# EAGLE design IMU (EAGLE 7.1.0)
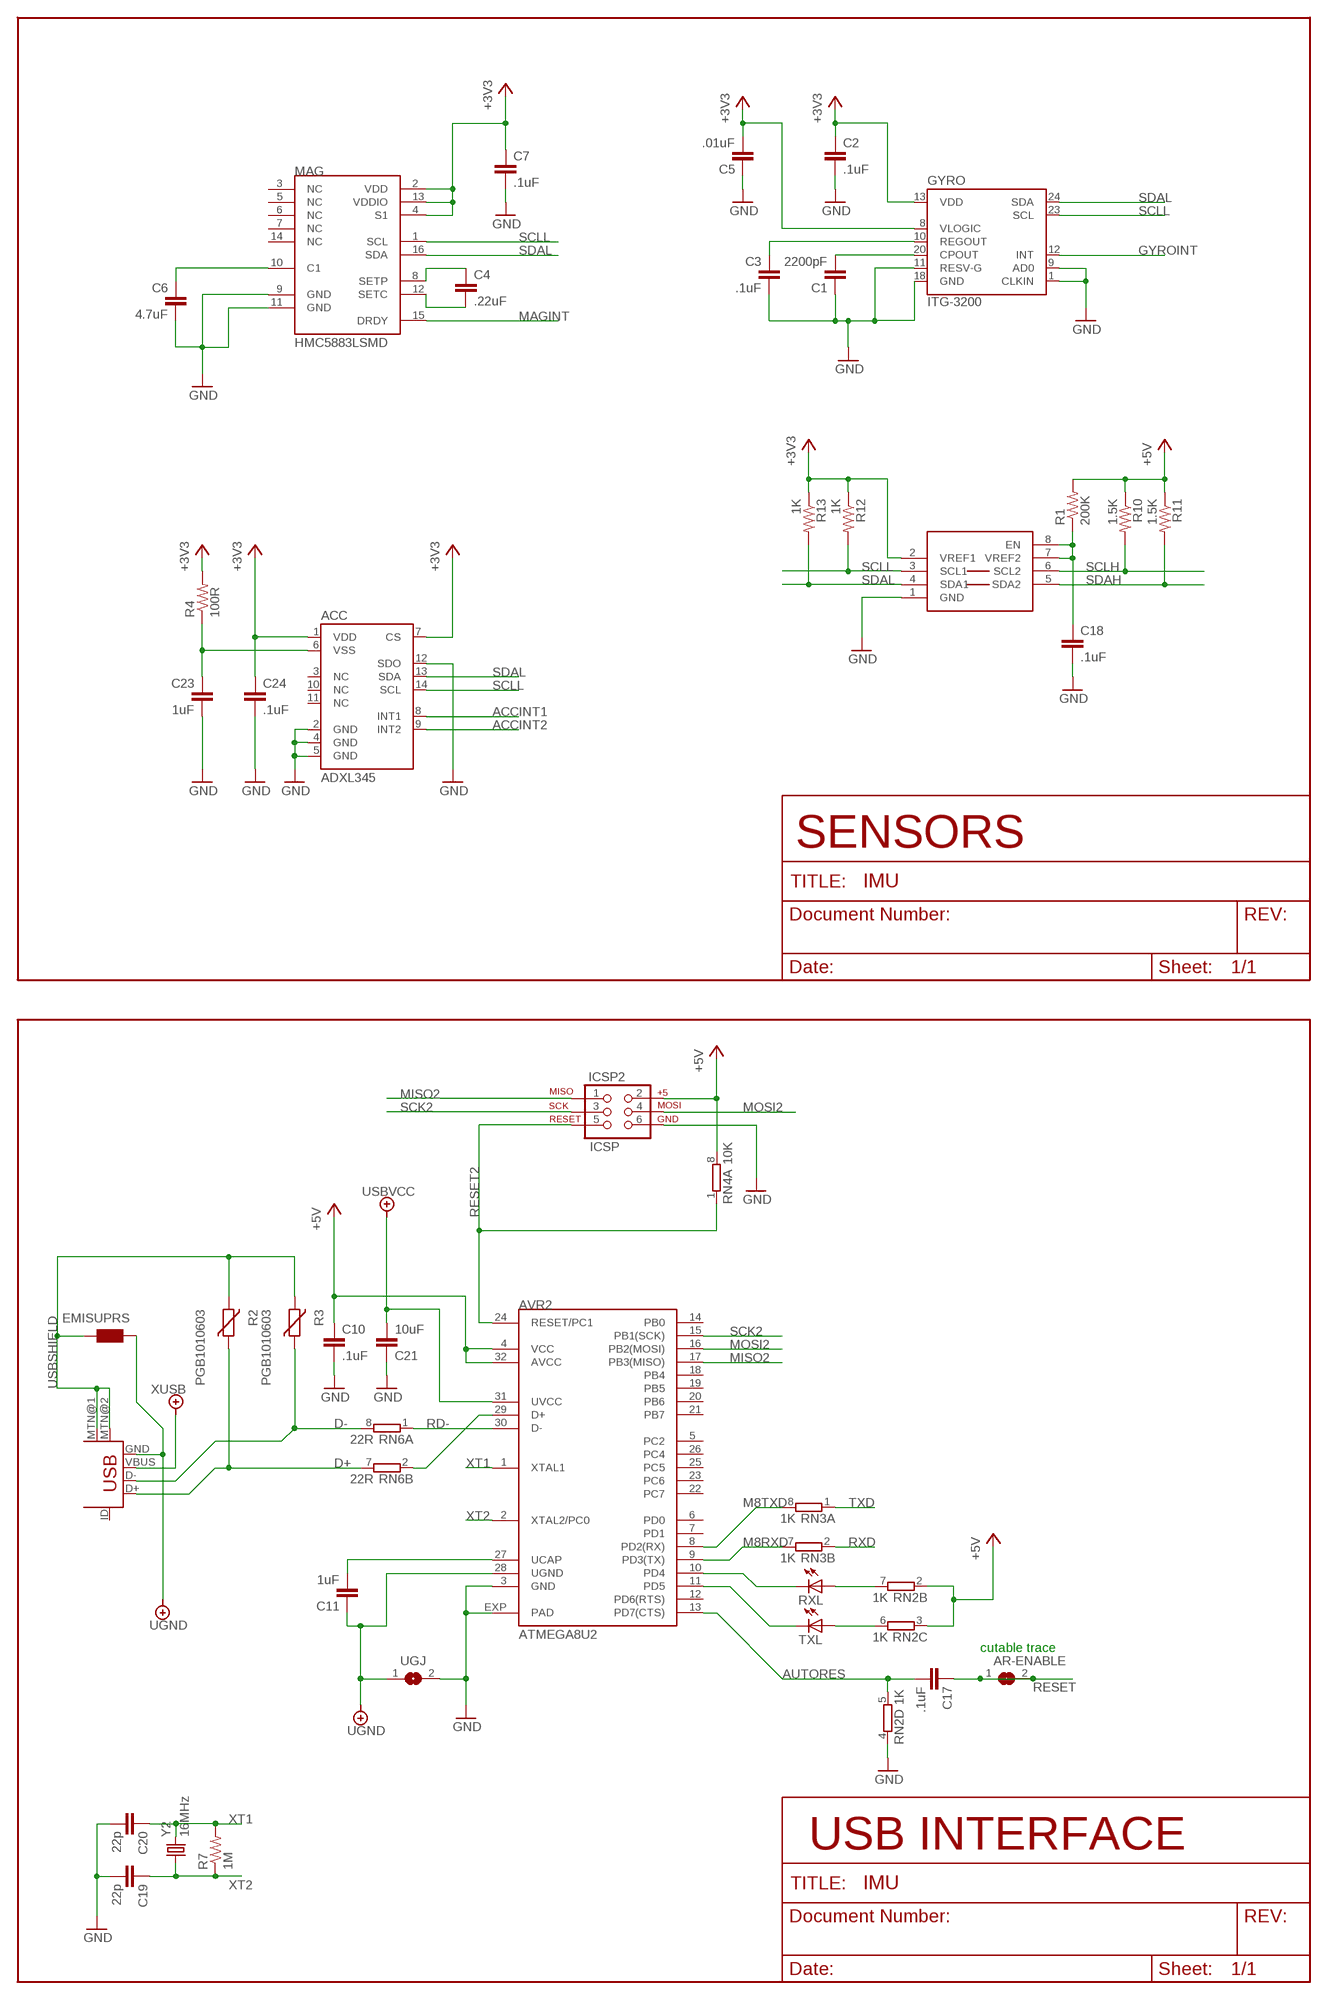
[diagram p0: schematic, sheet 1, part 1 of 2]
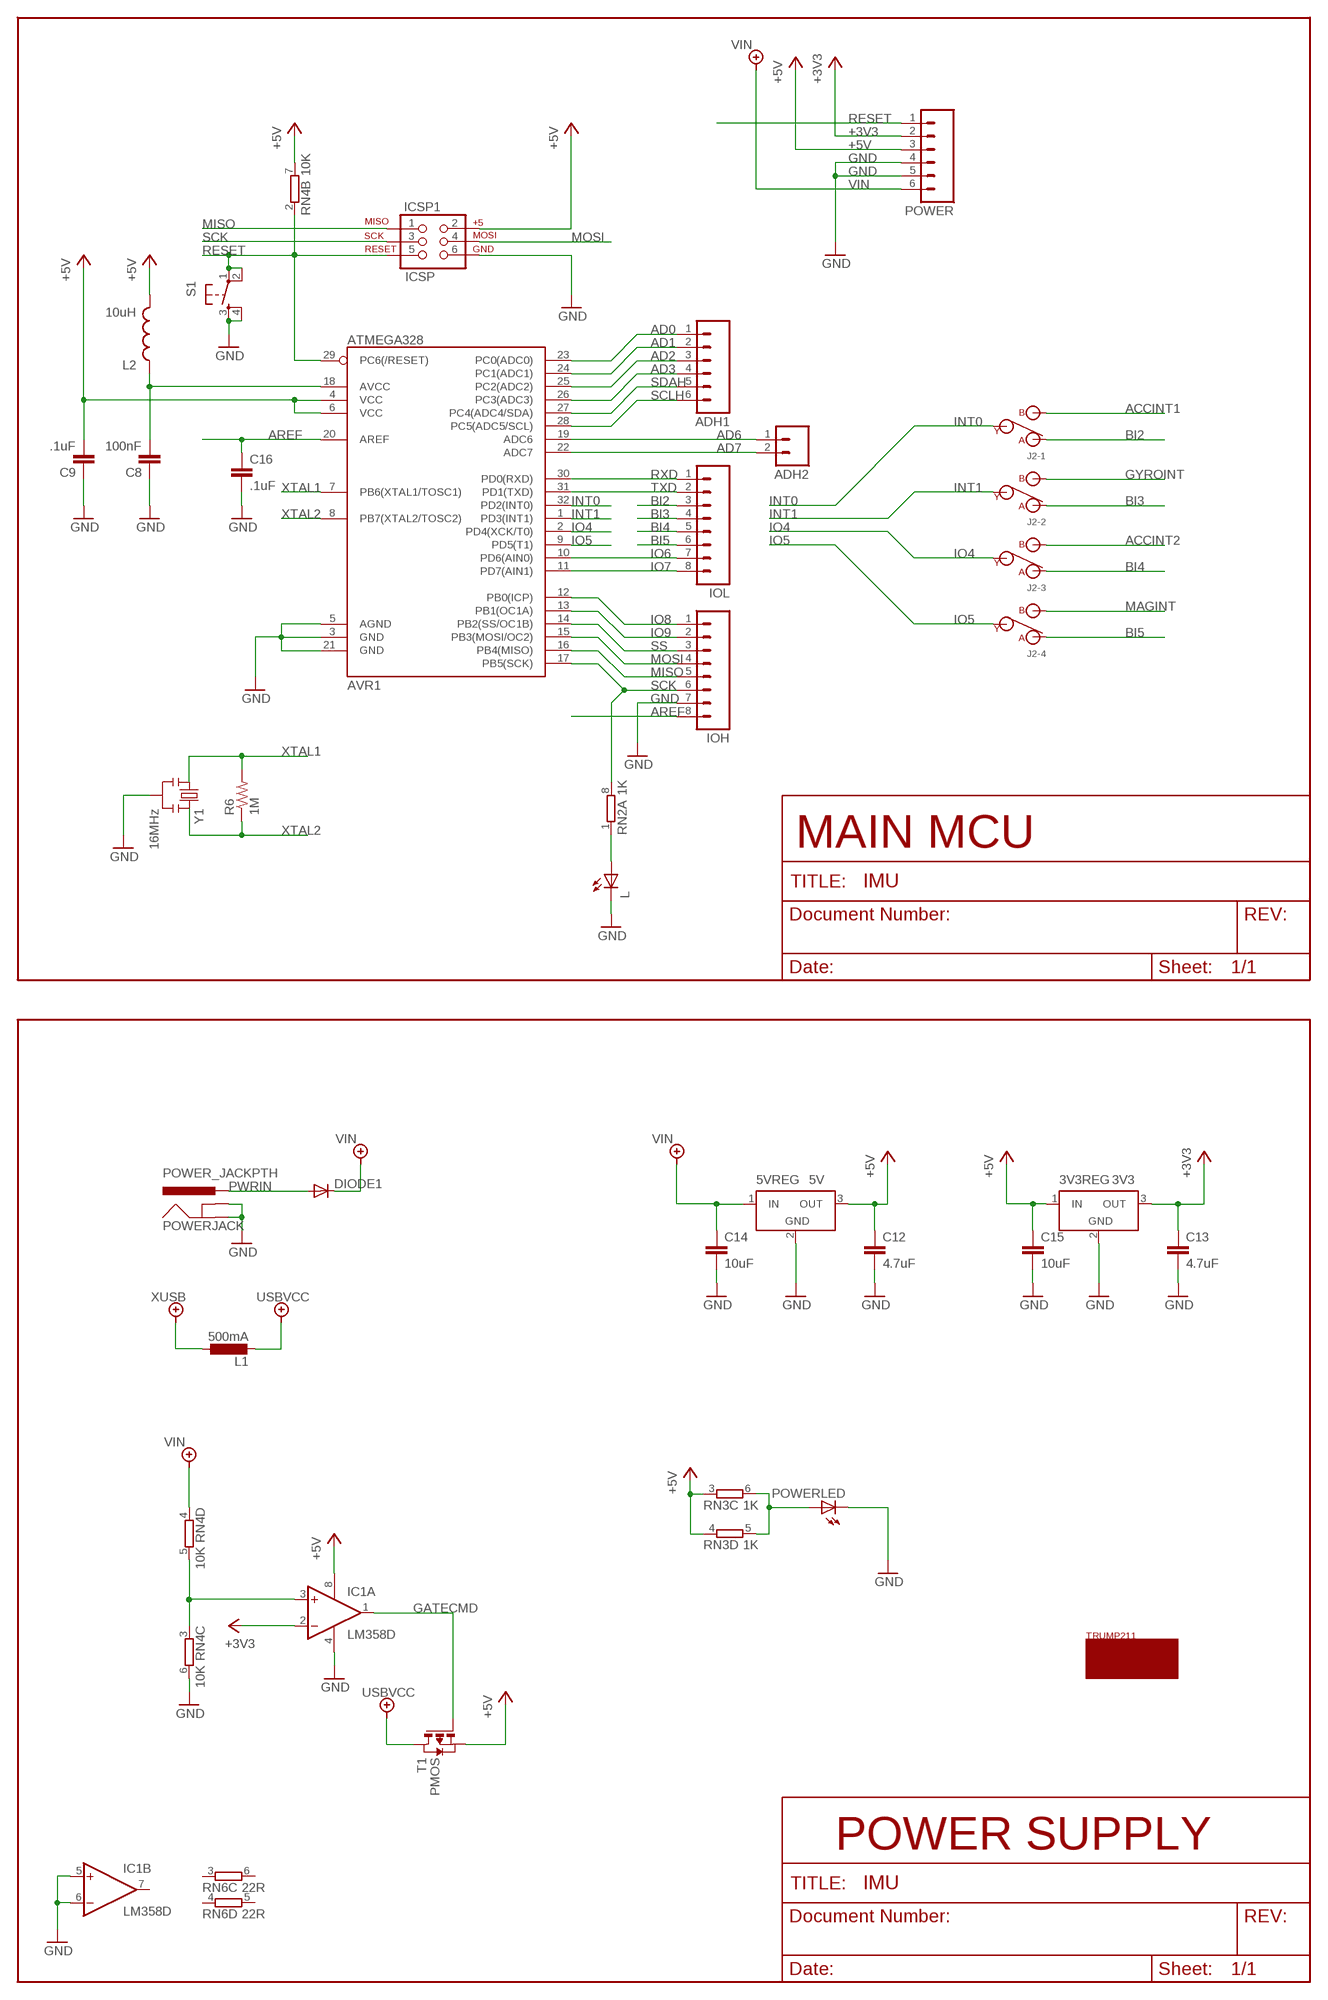
[diagram p1: schematic, sheet 1, part 2 of 2]

## Parts
3V3REG  3V3  LT1129CST5  [SOT223]
5VREG  5V  LT1129CST5  [SOT223]
ACC  ADXL345  [LGA14]
ADH1  M06LOCK  [1X06_LOCK]
ADH2  M02LOCK  [1X02_LOCK]
AR-ENABLE  SJ  [SJ]
AVR1  ATMEGA328  ATMEGA168  [TQFP32-08]
AVR2  ATMEGA8U2  [QFN32]
C1  2200pF  C-EUC0603  [C0603]
C2  .1uF  C-EUC0603  [C0603]
C3  .1uF  C-EUC0603  [C0603]
C4  .22uF  C-EUC0805  [C0805]
C5  .01uF  C-EUC0603  [C0603]
C6  4.7uF  C-EUC0805  [C0805]
C7  .1uF  C-EUC0603  [C0603]
C8  100nF  C-EUC0603  [C0603]
C9  .1uF  C-EUC0603  [C0603]
C10  .1uF  C-EUC0603  [C0603]
C11  1uF  C-EUC0603  [C0603]
C12  4.7uF  C-EUC1206  [C1206]
C13  4.7uF  C-EUC1206  [C1206]
C14  10uF  C-EUC1206  [C1206]
C15  10uF  C-EUC1206  [C1206]
C16  .1uF  C-EUC0603  [C0603]
C17  .1uF  C-EUC0603  [C0603]
C18  .1uF  C-EUC0603  [C0603]
C19  22p  C-EUC0603  [C0603]
C20  22p  C-EUC0603  [C0603]
C21  10uF  C-EUC0805  [C0805]
C23  1uF  C-EUC0805  [C0805]
C24  .1uF  C-EUC0603  [C0603]
DIODE1  DIODESMA  [SMA-DIODE]
EMISUPRS  WE-CBF_0805  [0805]
GYRO  ITG-3200  [QFN-24]
IC1  LM358D  [SO08]
ICSP1  ICSP  AVR_SPI_PRG_62X3_LOCK  [2X3_LOCK]
ICSP2  ICSP  AVR_SPI_PRG_62X3_LOCK  [2X3_LOCK]
IOH  M08LOCK  [1X08_LOCK]
IOL  M08LOCK  [1X08_LOCK]
J2  4POS_SPDT_DIP  [4X3_JUMP]
L  LEDCHIP-LED0805  [CHIP-LED0805]
L1  500mA  L-EUL1812  [L1812]
L2  10uH  INDUCTOR0805  [0805]
MAG  HMC5883LSMD  [16LPCC]
MINIUSB  USBMINI  [USBMINI]
POWER  M06LOCK  [1X06_LOCK]
POWERJACK  POWER_JACKPTH  [POWER_JACK_PTH]
POWERLED  LEDCHIP-LED0805  [CHIP-LED0805]
R1  200K  R-US_R0603  [R0603]
R2  PGB1010603  VARISTORCN0603  [CT/CN0603]
R3  PGB1010603  VARISTORCN0603  [CT/CN0603]
R4  100R  R-US_R0603  [R0603]
R6  1M  R-US_R0603  [R0603]
R7  1M  R-US_R0603  [R0603]
R10  1.5K  R-US_R0603  [R0603]
R11  1.5K  R-US_R0603  [R0603]
R12  1K  R-US_R0603  [R0603]
R13  1K  R-US_R0603  [R0603]
RN2  1K  4R-NCAY16  [CAY16]
RN3  1K  4R-NCAY16  [CAY16]
RN4  10K  4R-NCAY16  [CAY16]
RN6  22R  4R-NCAY16  [CAY16]
RXL  LEDCHIP-LED0805  [CHIP-LED0805]
S1  TAC_SWITCHSMD  [TACTILE_SWITCH_SMD]
T1  PMOS  PMOSSOT23  [SOT-23]
TRANSLATOR  PCA9306  [PSOP-8]
TXL  LEDCHIP-LED0805  [CHIP-LED0805]
U$1  TRUMPLOGO  [TRUMPLOGO]
UGJ  SJ  [SJ]
Y1  16MHz  RESONATORSMD  [RESONATOR-SMD]
Y2  16MHz  CRYSTAL  [CRYSTALSMD]

## Nets
5VREF: C18.1 R1.1 TRANSLATOR.7(VREF2) TRANSLATOR.8(EN)
+3V3: 3V3REG.3(OUT) ACC.1(VDD) ACC.7(CS) C2.1 C5.2 C7.1 C13.1 C24.1 GYRO.8(VLOGIC) GYRO.13(VDD) IC1.2(A:-IN) MAG.2(VDD) MAG.4(S1) MAG.13(VDDIO) POWER.2 R4.2 R12.1 R13.1 TRANSLATOR.2(VREF1)
+5V: 3V3REG.1(IN) 5VREG.3(OUT) AVR1.4(VCC) AVR1.6(VCC) AVR2.4(VCC) AVR2.32(AVCC) C9.2 C10.1 C12.1 C15.1 IC1.8(P:V+) ICSP1.2 ICSP2.2 L2.2 POWER.3 R1.2 R10.1 R11.1 RN2.2 RN2.3 RN3.3 RN3.4 RN4.7 RN4.8 T1.2(S)
ACCINT1: ACC.8(INT1) J2.R1(-1:B)
ACCINT2: ACC.9(INT2) J2.R3(-3:B)
AD0: ADH1.1 AVR1.23(PC0(ADC0))
AD1: ADH1.2 AVR1.24(PC1(ADC1))
AD2: ADH1.3 AVR1.25(PC2(ADC2))
AD3: ADH1.4 AVR1.26(PC3(ADC3))
AD6: ADH2.1 AVR1.19(ADC6)
AD7: ADH2.2 AVR1.22(ADC7)
AREF: AVR1.20(AREF) C16.1 IOH.8
AUTORES: AVR2.13(PD7(CTS)) C17.2 RN2.5
BI2: IOL.3 J2.L1(-1:A)
BI3: IOL.4 J2.L2(-2:A)
BI4: IOL.5 J2.L3(-3:A)
BI5: IOL.6 J2.L4(-4:A)
CPOUT: C1.2 GYRO.20(CPOUT)
D+: MINIUSB.D+ R2.1 RN6.7
D-: MINIUSB.D- R3.1 RN6.8
GATECMD: IC1.1(A:OUT) T1.3(G)
GND: 3V3REG.2(GND) 5VREG.2(GND) ACC.2(GND) ACC.4(GND) ACC.5(GND) ACC.12(SDO) AVR1.3(GND) AVR1.5(AGND) AVR1.21(GND) AVR2.3(GND) AVR2.EXP(PAD) C1.1 C2.2 C3.2 C5.1 C6.2 C7.2 C8.1 C9.1 C10.2 C12.2 C13.2 C14.2 C15.2 C16.2 C18.2 C19.2 C20.2 C21.1 C23.2 C24.2 GYRO.1(CLKIN) GYRO.9(AD0) GYRO.11(RESV-G) GYRO.18(GND) IC1.4(P:V-) IC1.5(B:+IN) IC1.6(B:-IN) ICSP1.6 ICSP2.6 IOH.7 L.C MAG.9(GND) MAG.11(GND) POWER.4 POWER.5 POWERJACK.GND POWERJACK.GNDBREAK POWERLED.C RN2.4 RN4.6 S1.3 S1.4 TRANSLATOR.1(GND) UGJ.2 Y1.2
GYROINT: GYRO.12(INT) J2.R2(-2:B)
INT0: AVR1.32(PD2(INT0)) J2.M1(-1:Y)
INT1: AVR1.1(PD3(INT1)) J2.M2(-2:Y)
IO4: AVR1.2(PD4(XCK/T0)) J2.M3(-3:Y)
IO5: AVR1.9(PD5(T1)) J2.M4(-4:Y)
IO6: AVR1.10(PD6(AIN0)) IOL.7
IO7: AVR1.11(PD7(AIN1)) IOL.8
IO8: AVR1.12(PB0(ICP)) IOH.1
IO9: AVR1.13(PB1(OC1A)) IOH.2
M8RXD: AVR2.9(PD3(TX)) RN3.7
M8TXD: AVR2.8(PD2(RX)) RN3.8
MAGINT: J2.R4(-4:B) MAG.15(DRDY)
MISO: AVR1.16(PB4(MISO)) ICSP1.1 IOH.5
MISO2: AVR2.17(PB3(MISO)) ICSP2.1
MOSI: AVR1.15(PB3(MOSI/OC2)) ICSP1.4 IOH.4
MOSI2: AVR2.16(PB2(MOSI)) ICSP2.4
N$1: C6.1 MAG.10(C1)
N$2: C3.1 GYRO.10(REGOUT)
N$5: ACC.6(VSS) C23.1 R4.1
N$8: RN2.7 RXL.A
N$9: RN2.6 TXL.A
N$10: AVR1.18(AVCC) C8.2 L2.1
N$99: L.A RN2.1
PWRIN: DIODE1.A POWERJACK.PWR
PWRLED: POWERLED.A RN3.5 RN3.6
RD+: AVR2.29(D+) RN6.2
RD-: AVR2.30(D-) RN6.1
RESET: AR-ENABLE.1 AR-ENABLE.2 AVR1.29(PC6(/RESET)) C17.1 ICSP1.5 POWER.1 RN4.2 S1.1 S1.2
RESET2: AVR2.24(RESET/PC1) ICSP2.5 RN4.1
RXD: AVR1.30(PD0(RXD)) IOL.1 RN3.2
RXLED: AVR2.10(PD4) RXL.C
SCK: AVR1.17(PB5(SCK)) ICSP1.3 IOH.6 RN2.8
SCK2: AVR2.15(PB1(SCK)) ICSP2.3
SCLH: ADH1.6 AVR1.28(PC5(ADC5/SCL)) R10.2 TRANSLATOR.6(SCL2)
SCLL: ACC.14(SCL) GYRO.23(SCL) MAG.1(SCL) R12.2 TRANSLATOR.3(SCL1)
SDAH: ADH1.5 AVR1.27(PC4(ADC4/SDA)) R11.2 TRANSLATOR.5(SDA2)
SDAL: ACC.13(SDA) GYRO.24(SDA) MAG.16(SDA) R13.2 TRANSLATOR.4(SDA1)
SETC: C4.2 MAG.12(SETC)
SETP: C4.1 MAG.8(SETP)
SS: AVR1.14(PB2(SS/OC1B)) IOH.3
TXD: AVR1.31(PD1(TXD)) IOL.2 RN3.1
TXLED: AVR2.11(PD5) TXL.C
UGND: AVR2.28(UGND) C11.1 EMISUPRS.1 MINIUSB.GND UGJ.1
USBSHIELD: EMISUPRS.2 MINIUSB.MTN@1 MINIUSB.MTN@2 R2.2 R3.2
USBVCC: AVR2.31(UVCC) C21.2 L1.2 T1.1(D)
VIN: 5VREG.1(IN) C14.1 DIODE1.C POWER.6 RN4.4
VIN/2: IC1.3(A:+IN) RN4.3 RN4.5
VUCAP: AVR2.27(UCAP) C11.2
XT1: AVR2.1(XTAL1) C20.1 R7.2 Y2.3
XT2: AVR2.2(XTAL2/PC0) C19.1 R7.1 Y2.1
XTAL1: AVR1.7(PB6(XTAL1/TOSC1)) R6.2 Y1.1
XTAL2: AVR1.8(PB7(XTAL2/TOSC2)) R6.1 Y1.3
XUSB: L1.1 MINIUSB.VBUS
Unconnected: ACC.3(NC) ACC.10(NC) ACC.11(NC) AVR2.5(PC2) AVR2.6(PD0) AVR2.7(PD1) AVR2.12(PD6(RTS)) AVR2.14(PB0) AVR2.18(PB4) AVR2.19(PB5) AVR2.20(PB6) AVR2.21(PB7) AVR2.22(PC7) AVR2.23(PC6) AVR2.25(PC5) AVR2.26(PC4) IC1.7(B:OUT) MAG.3(NC) MAG.5(NC) MAG.6(NC) MAG.7(NC) MAG.14(NC) MINIUSB.ID RN6.3 RN6.4 RN6.5 RN6.6

## Notes on the sheet
- SENSORS | MAIN MCU
- cutable trace
- USB INTERFACE | POWER SUPPLY

## Power pins joined to a net without a drawn wire
GND: 3V3REG.4(GND) 5VREG.4(GND) Y2.2(GND) Y2.4(GND)

## Library data of the parts
3V3REG 5VREG = linear-technology:LT1129CST5: VOLTAGE REGULATOR with shutdown; MPN: LT1129CST-5#PBF; OC_FARNELL: 1663375; OC_NEWARK: 57M2069
ACC = SparkFun:ADXL345
ADH1 POWER = SparkFun:M06: Header 6 Standard 6-pin 0.1" header. Use with straight break away headers (SKU : PRT-00116), right angle break away headers (PRT-00553), swiss pins (PRT-00743), machine pins (PRT-00117), and female headers (PRT-00115). Molex polarized connector foot print use with SKU : PRT-08094 with associated crimp pins and housings. NOTES ON THE VARIANTS LOCK and LOCK_LONGPADS... This footprint was designed to help hold the alignment of a through-hole component (i.e. 6-pin header) while soldering it into place. You may notice that each hole has been shifted either up or down by 0.005 of an inch from it's more standard position (which is a perfectly straight line). This slight alteration caused the pins (the squares in the middle) to touch the edges of the holes. Because they are alternating, it causes a "brace" to hold the component in place. 0.005 has proven to be the perfect amount of "off-center" position when using our standard breakaway headers. Although looks a little odd when you look at the bare footprint, once you have a header in there, the alteration is very hard to notice. Also, if you push a header all the way into place, it is covered up entirely on the bottom side. This idea of altering the position of holes to aid alignment will be further integrated into the Sparkfun Library for other footprints. It can help hold any component with 3 or more connection pins.
ADH2 = SparkFun:M02: Header 2 Standard 2-pin 0.1" header. Use with straight break away headers (SKU : PRT-00116), right angle break away headers (PRT-00553), swiss pins (PRT-00743), machine pins (PRT-00117), and female headers (PRT-00115). Molex polarized connector foot print use with SKU : PRT-08233 with associated crimp pins and housings.
AR-ENABLE UGJ = jumper:SJ: SMD solder JUMPER
AVR1 = SparkFun:ATMEGA168
AVR2 = Mine:ATMEGA8U2
C1-C21 C23 C24 = rcl:C-EU: CAPACITOR, European symbol
DIODE1 = SparkFun:DIODE: Diode These are standard reverse protection diodes and small signal diodes. SMA package can handle up to about 1A. SOD-323 can handle about 200mA. What the SOD-323 package when ordering, there are some mfgs out there that are 5-pin packages.
EMISUPRS = wuerth-elektronik:WE-CBF: SMD EMI Suppression Ferrite Beads - excellent anti-EMI properties - low DCR - impedances till 3000 ohms - rated current up to 6 A
GYRO = SparkFun:ITG-3200: ITG-3200 3-axis gyro, digital output, qfn24 package
IC1 = linear:LM358: OP AMP also LM158; LM258; LM2904 Source: http://cache.national.com/ds/LM/LM158.pdf
ICSP1 ICSP2 = SparkFun:AVR_SPI_PRG_6: AVR ISP 6 Pin This is the reduced ISP connector for AVR programming. Common on Arduino. This footprint will take up less PCB space and can be used with a 10-pin to 6-pin adapter such as SKU: BOB-08508
IOH IOL = SparkFun:M08: Header 8 Standard 8-pin 0.1" header. Use with straight break away headers (SKU : PRT-00116), right angle break away headers (PRT-00553), swiss pins (PRT-00743), machine pins (PRT-00117), and female headers (PRT-00115).
J2 = Mine:4POS_SPDT_DIP
L POWERLED RXL TXL = led:LED: LED OSRAM: - CHIPLED LG R971, LG N971, LY N971, LG Q971, LY Q971, LO R971, LY R971 LH N974, LH R974 LS Q976, LO Q976, LY Q976 LO Q996 - Hyper CHIPLED LW Q18S LB Q993, LB Q99A, LB R99A - SideLED LS A670, LO A670, LY A670, LG A670, LP A670 LB A673, LV A673, LT A673, LW A673 LH A674 LY A675 LS A676, LA A676, LO A676, LY A676, LW A676 LS A679, LY A679, LG A679 - Hyper Micro SIDELED� LS Y876, LA Y876, LO Y876, LY Y876 LT Y87S - SmartLED LW L88C, LW L88S LB L89C, LB L89S, LG L890 LS L89K, LO L89K, LY L89K LS L896, LA L896, LO L896, LY L896 - TOPLED LS T670, LO T670, LY T670, LG T670, LP T670 LSG T670, LSP T670, LSY T670, LOP T670, LYG T670 LG T671, LOG T671, LSG T671 LB T673, LV T673, LT T673, LW T673 LH T674 LS T676, LA T676, LO T676, LY T676, LB T676, LH T676, LSB T676, LW T676 LB T67C, LV T67C, LT T67C, LS T67K, LO T67K, LY T67K, LW E67C LS E67B, LA E67B, LO E67B, LY E67B, LB E67C, LV E67C, LT E67C LW T67C LS T679, LY T679, LG T679 LS T770, LO T770, LY T770, LG T770, LP T770 LB T773, LV T773, LT T773, LW T773 LH T774 LS E675, LA E675, LY E675, LS T675 LS T776, LA T776, LO T776, LY T776, LB T776 LHGB T686 LT T68C, LB T68C - Hyper Mini TOPLED� LB M676 - Mini TOPLED Santana� LG M470 LS M47K, LO M47K, LY M47K Source: http://www.osram.convergy.de LUXEON: - LUMILED� LXK2-PW12-R00, LXK2-PW12-S00, LXK2-PW14-U00, LXK2-PW14-V00 LXK2-PM12-R00, LXK2-PM12-S00, LXK2-PM14-U00 LXK2-PE12-Q00, LXK2-PE12-R00, LXK2-PE12-S00, LXK2-PE14-T00, LXK2-PE14-U00 LXK2-PB12-K00, LXK2-PB12-L00, LXK2-PB12-M00, LXK2-PB14-N00, LXK2-PB14-P00, LXK2-PB14-Q00 LXK2-PR12-L00, LXK2-PR12-M00, LXK2-PR14-Q00, LXK2-PR14-R00 LXK2-PD12-Q00, LXK2-PD12-R00, LXK2-PD12-S00 LXK2-PH12-R00, LXK2-PH12-S00 LXK2-PL12-P00, LXK2-PL12-Q00, LXK2-PL12-R00 Source: www.luxeon.com KINGBRIGHT: KA-3528ASYC Source: www.kingbright.com
L1 = rcl:L-EU: INDUCTOR, European symbol
L2 = SparkFun-Passives:INDUCTOR: Inductors Basic Inductor/Choke - 0603 and 1206. Footprints are not proven and vary greatly between part numbers. SRN6045- 33uH, 20% 1.4A
MAG = SparkFun:HMC5883L: 3 Axis Digital Compass IC
MINIUSB = Mine:USBMINI
POWERJACK = SparkFun:POWER_JACK: Power Jack This is the standard 5.5mm barrel jack for power. The PTH is the most common, proven, reliable, footprint. All others are experimental. The Slot footprint only works if the mill layer is transmitted to the PCB fab house so be warned. Spark Fun Electronics SKU : PRT-00119. Mating wall wart : TOL-00298 (and others)
R1 R4 R6 R7 R10-R13 = rcl:R-US_: RESISTOR, American symbol
R2 R3 = varistor:VARISTOR: VARISTOR
RN2-RN4 RN6 = resistor-dil:4R-N: Array Chip Resistor Source: RS Component / Phycomp; OC_FARNELL: unknown; OC_NEWARK: unknown
S1 = SparkFun:TAC_SWITCH: Momentary Switch Button commonly used for reset or general input. Spark Fun Electronics SKU : COM-00097
T1 = zetex:PMOSSOT23: MOS FET; OC_FARNELL: unknown; OC_NEWARK: unknown
TRANSLATOR = SparkFun:PCA9306
U$1 = untitled:TRUMPLOGO
Y1 = SparkFun:RESONATOR: Resonator Small SMD resonator. This is the itty bitty 10/20MHz resonators with built in caps. CSTCE10M0G55 and CSTCE20M0V53. Footprint has been reviewed closely but hasn't been tested yet.
Y2 = Mine:CRYSTAL

## Board
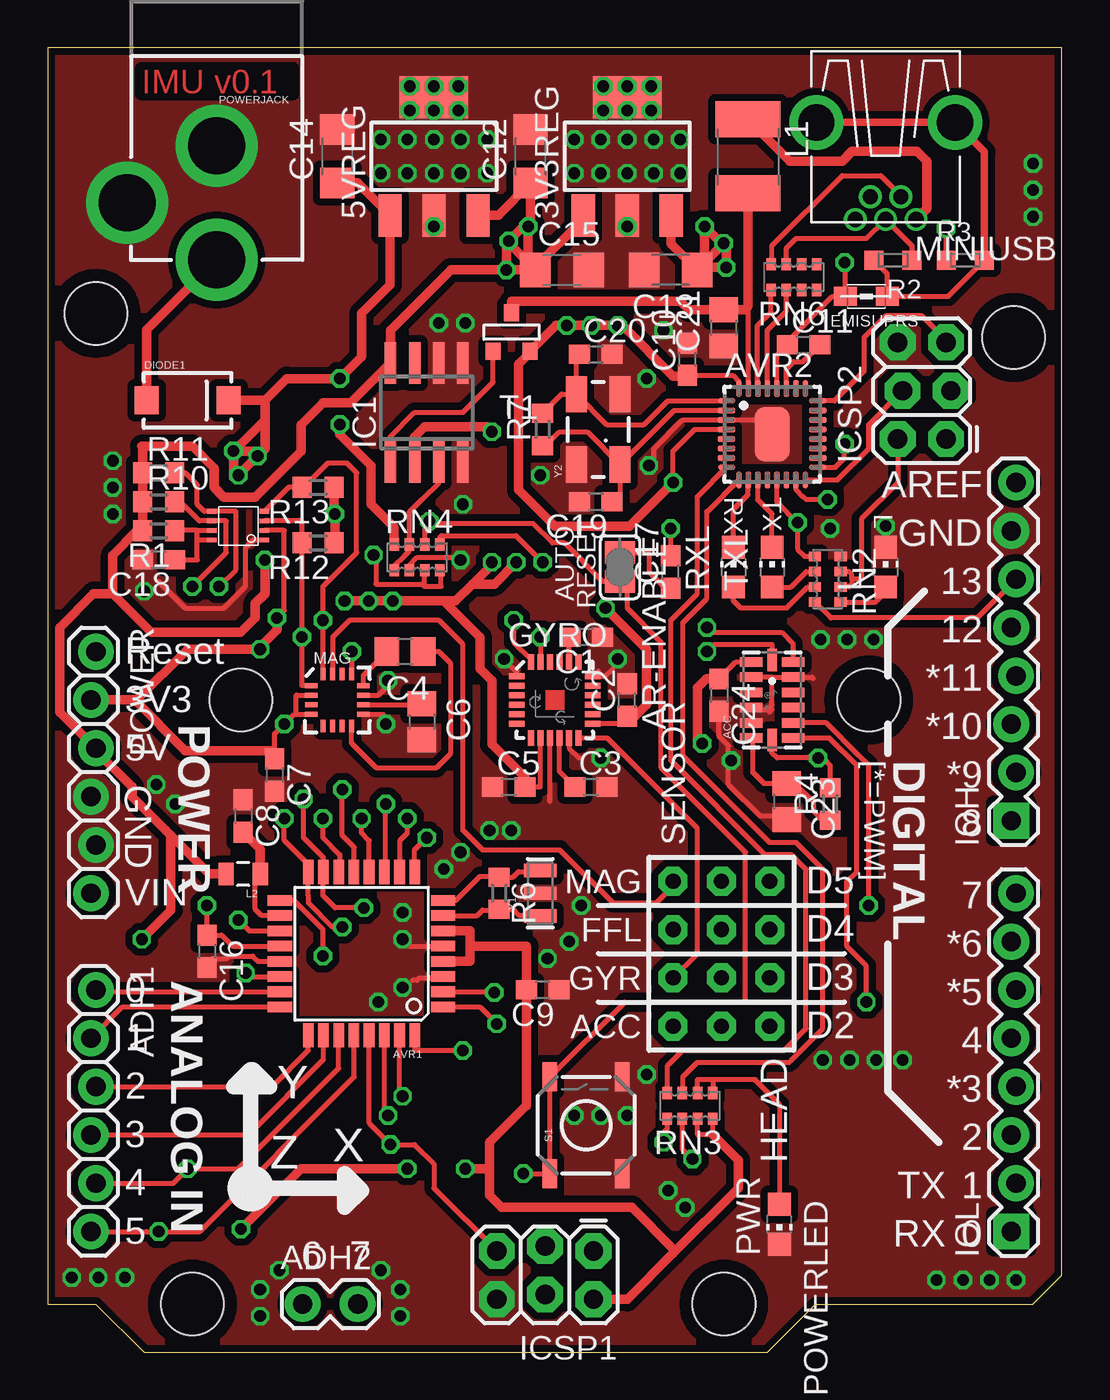
[diagram p2: board, top side]
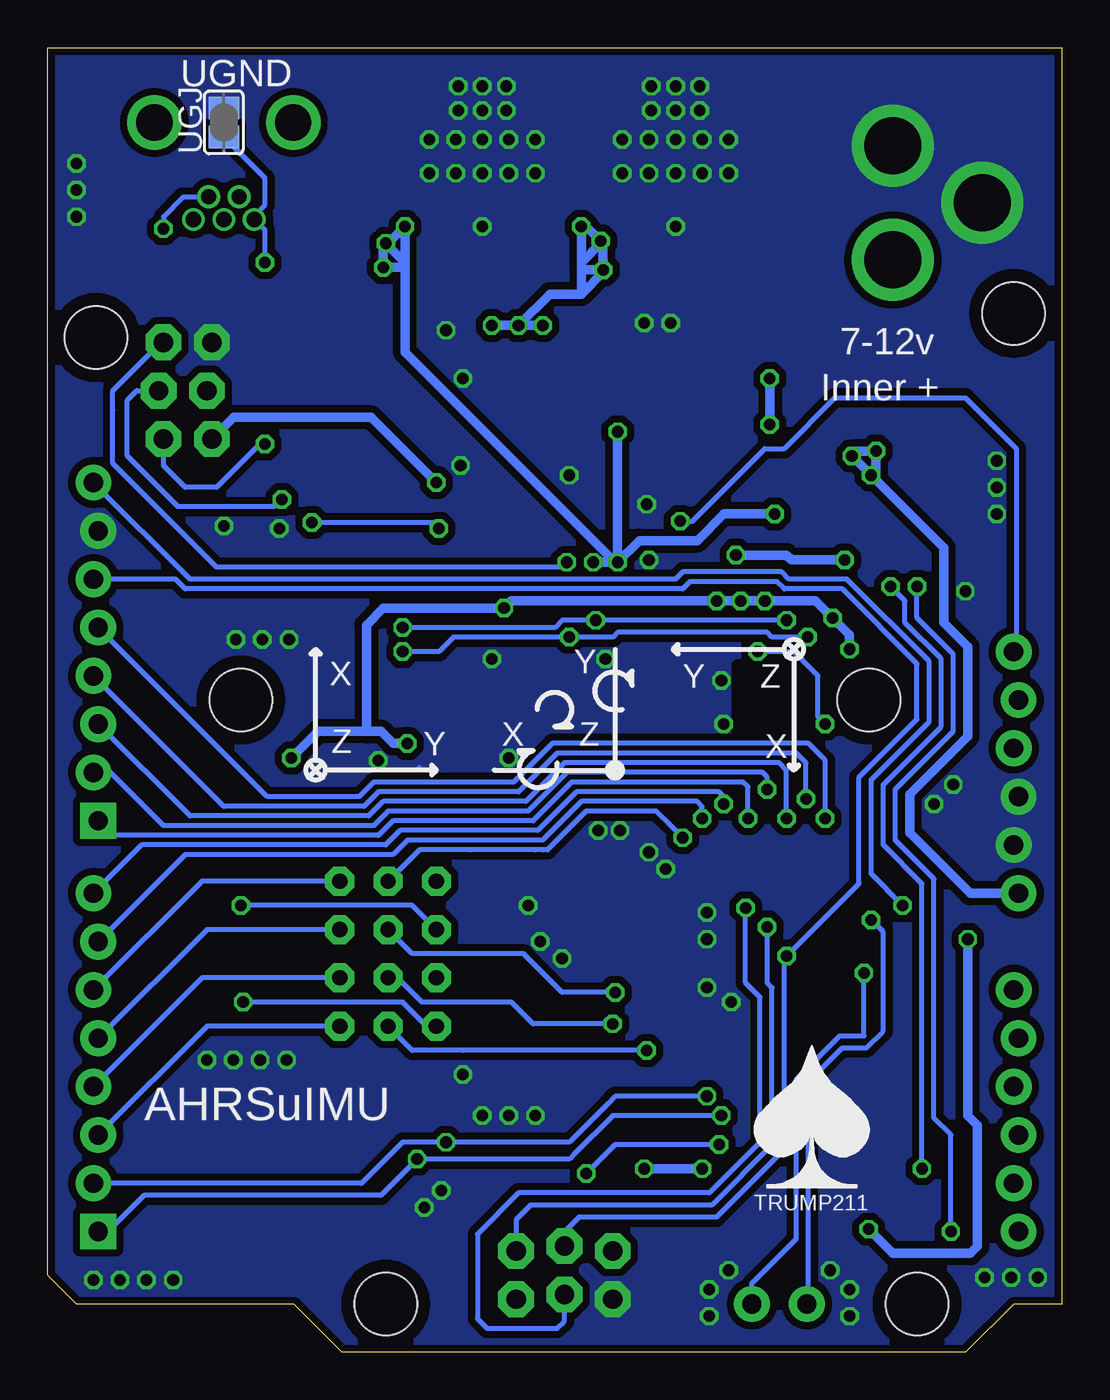
[diagram p3: board, bottom side, seen from below]

Size 53.34 x 68.58 mm. Coordinates in mm from the lower left corner, seen from the top.
Outline: 5.08,0 37.85,0 40.39,2.54 51.82,2.54 53.34,4.06 53.34,68.58 0,68.58 0,2.54 2.54,2.54 5.08,0
Copper layers (1*16): Top 0.0356mm / dielectric 1.5011mm / Bottom 0.0356mm
Design rules "default": minimum track width 6mil, minimum drill 13mil, track to track 6mil, track to pad 6mil, pad to pad 6mil, via to via 6mil, smd to smd 6mil, copper to edge 15mil, drill to drill 6mil, minimum pad ring 7mil, minimum via ring 7mil, stop-mask expansion 4mil, vias tented up to drill 24mil, thermal gap 10mil
bRestrict: area 13.5,32.5 to 17,36.1

### Footprints (pad centres in the part's own frame; a part is rotated, then mirrored left to right if it is on the bottom)
SOT223 = smd 1.219 x 2.235: 1 -2.311,-3.099; 2 0,-3.099; 3 2.311,-3.099 | smd 3.6 x 2.2: 4 0,3.099
LGA14 = smd 0.5 x 1.2: 1 2,1.1; 2 1.2,1.1; 3 0.4,1.1; 4 -0.4,1.1; 5 -1.2,1.1; 6 -2,1.1; 8 -2,-1.1; 9 -1.2,-1.1; 10 -0.4,-1.1; 11 0.4,-1.1; 12 1.2,-1.1; 13 2,-1.1 | smd 1.2 x 0.5: 7 -2.1,0; 14 2.1,0
1X06_LOCK = drill 1.016 pad 1.88: 1 0,0; 2 2.54,-0.254; 3 5.08,0; 4 7.62,-0.254; 5 10.16,0; 6 12.7,-0.254
1X02_LOCK = drill 1.016 pad 1.88: 1 -0.178,0; 2 2.718,0
SJ = smd 1.168 x 1.6: 1 -0.762,0; 2 0.762,0
TQFP32-08 = smd 1.27 x 0.559: 1 -4.293,2.8; 2 -4.293,2; 3 -4.293,1.2; 4 -4.293,0.4; 5 -4.293,-0.4; 6 -4.293,-1.2; 7 -4.293,-2; 8 -4.293,-2.8; 17 4.293,-2.8; 18 4.293,-2; 19 4.293,-1.2; 20 4.293,-0.4; 21 4.293,0.4; 22 4.293,1.2; 23 4.293,2; 24 4.293,2.8 | smd 0.559 x 1.27: 9 -2.8,-4.293; 10 -2,-4.293; 11 -1.2,-4.293; 12 -0.4,-4.293; 13 0.4,-4.293; 14 1.2,-4.293; 15 2,-4.293; 16 2.8,-4.293; 25 2.8,4.293; 26 2,4.293; 27 1.2,4.293; 28 0.4,4.293; 29 -0.4,4.293; 30 -1.2,4.293; 31 -2,4.293; 32 -2.8,4.293
QFN32 = smd 0.9 x 0.3: 1 -2.4,1.75; 2 -2.4,1.25; 3 -2.4,0.75; 4 -2.4,0.25; 5 -2.4,-0.25; 6 -2.4,-0.75; 7 -2.4,-1.25; 8 -2.4,-1.75; 17 2.4,-1.75; 18 2.4,-1.25; 19 2.4,-0.75; 20 2.4,-0.25; 21 2.4,0.25; 22 2.4,0.75; 23 2.4,1.25; 24 2.4,1.75 | smd 0.3 x 0.9: 9 -1.75,-2.4; 10 -1.25,-2.4; 11 -0.75,-2.4; 12 -0.25,-2.4; 13 0.25,-2.4; 14 0.75,-2.4; 15 1.25,-2.4; 16 1.75,-2.4; 25 1.75,2.4; 26 1.25,2.4; 27 0.75,2.4; 28 0.25,2.4; 29 -0.25,2.4; 30 -0.75,2.4; 31 -1.25,2.4; 32 -1.75,2.4 | smd 1.85 x 2.85: EXP 0,0
C0603 = smd 1.1 x 1: 1 -0.85,0; 2 0.85,0
C0805 = smd 1.3 x 1.5: 1 -0.95,0; 2 0.95,0
C1206 = smd 1.6 x 1.8: 1 -1.4,0; 2 1.4,0
SMA-DIODE = smd 1.27 x 1.47: A -2.15,0; C 2.15,0
0805 = smd 1.2 x 1: 1 -1.1,0; 2 1.1,0
QFN-24 = smd 0.8 x 0.3: 1 -2,1.25; 2 -2,0.75; 3 -2,0.25; 4 -2,-0.25; 5 -2,-0.75; 6 -2,-1.25; 13 2,-1.25; 14 2,-0.75; 15 2,-0.25; 16 2,0.25; 17 2,0.75; 18 2,1.25 | smd 0.3 x 0.8: 7 -1.25,-2; 8 -0.75,-2; 9 -0.25,-2; 10 0.25,-2; 11 0.75,-2; 12 1.25,-2; 19 1.25,2; 20 0.75,2; 21 0.25,2; 22 -0.25,2; 23 -0.75,2; 24 -1.25,2
SO08 = smd 0.6 x 2.2: 1 -1.905,-2.6; 2 -0.635,-2.6; 3 0.635,-2.6; 4 1.905,-2.6; 5 1.905,2.6; 6 0.635,2.6; 7 -0.635,2.6; 8 -1.905,2.6
2X3_LOCK = drill 1.016 pad 1.88 octagon: 1 0,0; 2 0,2.54; 3 2.54,-0.254; 4 2.54,2.286; 5 5.08,0; 6 5.08,2.54
1X08_LOCK = drill 1.016 pad 1.88 square: 1 0,0.127 | drill 1.016 pad 1.88: 2 2.54,-0.127; 3 5.08,0.127; 4 7.62,-0.127; 5 10.16,0.127; 6 12.7,-0.127; 7 15.24,0.127; 8 17.78,-0.127
4X3_JUMP = drill 0.8 pad 1.524 octagon: L1 -2.54,3.81; L2 -2.54,1.27; L3 -2.54,-1.27; L4 -2.54,-3.81; M1 0,3.81; M2 0,1.27; M3 0,-1.27; M4 0,-3.81; R1 2.54,3.81; R2 2.54,1.27; R3 2.54,-1.27; R4 2.54,-3.81
STAND-OFF = hole 3.302: 0,0
CHIP-LED0805 = smd 1.2 x 1.2: A 0,-1.05; C 0,1.05
L1812 = smd 1.9 x 3.4: 1 -1.95,0; 2 1.95,0
0805' = smd 0.8 x 1.2: 1 -0.9,0; 2 0.9,0
16LPCC = smd 0.65 x 0.28: 1 -1.37,0.75; 2 -1.37,0.25; 3 -1.37,-0.25; 4 -1.37,-0.75; 9 1.37,-0.75; 10 1.37,-0.25; 11 1.37,0.25; 12 1.37,0.75 | smd 0.28 x 0.65: 5 -0.75,-1.37; 6 -0.25,-1.37; 7 0.25,-1.37; 8 0.75,-1.37; 13 0.75,1.37; 14 0.25,1.37; 15 -0.25,1.37; 16 -0.75,1.37
USBMINI = drill 0.8: D+ 5.1,0; D- 3.9,0.8; GND 5.1,-1.6; ID 3.9,-0.8; VBUS 5.1,1.6 | drill 1.9: MTN@1 0,3.65; MTN@2 0,-3.65
POWER_JACK_PTH = drill 2.997 pad 4.318: GND 0,7.7; GNDBREAK 4.7,10.7; PWR 0,13.7
R0603 = smd 1 x 1.1: 1 -0.85,0; 2 0.85,0
CT/CN0603 = smd 1 x 1: 1 -1,0; 2 1,0
CAY16 = smd 0.5 x 0.65: 1 -1.2,-0.675; 2 -0.4,-0.675; 3 0.4,-0.675; 4 1.2,-0.675; 5 1.2,0.675; 6 0.4,0.675; 7 -0.4,0.675; 8 -1.2,0.675
TACTILE_SWITCH_SMD = smd 1.524 x 0.762: 1 -2.54,1.905; 2 2.54,1.905; 3 -2.54,-1.905; 4 2.54,-1.905
SOT-23 = smd 0.787 x 0.889: 1 0.025,-1.016; 2 -0.94,1.016; 3 0.991,1.016
PSOP-8 = smd 0.25 x 0.5: 1 -0.73,-1.37; 2 -0.23,-1.37; 3 0.27,-1.37; 4 0.77,-1.37; 5 0.77,1.38; 6 0.27,1.38; 7 -0.23,1.38; 8 -0.73,1.38
RESONATOR-SMD = smd 0.7 x 1.7: 1 -1.2,0; 2 0,0; 3 1.2,0
CRYSTALSMD = smd 1.9 x 1.1: 1 -1.85,-1.15; 2 1.85,-1.15; 3 1.85,1.15; 4 -1.85,1.15

### Placement (x,y rotation side)
3V3REG  30.48,62.86 0 top
5VREG  20.32,62.86 0 top
ACC  38.1,34.29 90 top
ADH1  2.54,19.05 270 top
ADH2  13.59,2.54 0 top
AR-ENABLE  30.1,41.27 270 top
AVR1  16.51,20.96 180 top
AVR2  38.1,48.26 0 top
C1  28.32,37.59 180 top
C2  30.48,34.29 90 top
C3  28.57,29.72 0 top
C4  18.8,36.83 180 top
C5  24.26,29.72 0 top
C6  19.68,33.15 270 top
C7  11.94,30.35 270 top
C8  10.29,28.19 270 top
C9  26.04,19.05 180 top
C10  33.66,52.2 90 top
C11  39.75,52.96 0 top
C12  25.4,62.86 90 top
C13  32.77,56.9 180 top
C14  15.24,62.86 90 top
C15  27.05,56.9 0 top
C16  8.38,21.08 270 top
C17  32.77,41.02 90 top
C18  5.84,41.66 180 top
C19  28.83,44.7 180 top
C20  28.83,52.45 0 top
C21  35.56,53.85 90 top
C23  38.86,28.96 270 top
C24  35.31,34.54 270 top
DIODE1  7.37,50.04 0 top
EMISUPRS  43.05,55.5 0 top
GYRO  26.67,34.29 0 top
IC1  19.94,49.4 0 top
ICSP1  28.7,5.33 180 top
ICSP2  47.24,48.01 90 top
IOH  50.8,27.94 90 top
IOL  50.8,6.35 90 top
J2  35.43,20.96 180 top
JP1  STAND-OFF  [STAND-OFF]  2.54,54.61 0 top
JP2  STAND-OFF  [STAND-OFF]  50.8,53.34 0 top
JP3  STAND-OFF  [STAND-OFF]  35.56,2.54 0 top
JP4  STAND-OFF  [STAND-OFF]  7.62,2.54 0 top
JP5  STAND-OFF  [STAND-OFF]  10.16,34.29 0 top
JP9  STAND-OFF  [STAND-OFF]  43.18,34.29 0 top
L  44.07,41.27 0 top
L1  36.83,62.86 270 top
L2  10uH  [0805']  10.29,25.15 180 top
MAG  15.24,34.29 0 top
MINIUSB  44.07,64.64 270 top
POWER  2.54,36.83 270 top
POWERJACK  8.89,71.12 180 top
POWERLED  38.48,6.73 180 top
R1  5.84,43.18 180 top
R2  44.45,57.4 180 top
R3  48.26,57.4 0 top
R4  41.15,28.83 90 top
R6  23.75,24.13 270 top
R7  26.04,48.51 90 top
R10  5.84,44.7 0 top
R11  5.84,46.23 0 top
R12  14.22,42.54 180 top
R13  14.22,45.47 180 top
RN2  41.02,40.64 90 top
RN3  33.78,12.95 0 top
RN4  19.43,41.78 180 top
RN6  39.24,56.52 0 top
RXL  36.07,41.27 0 top
S1  28.32,11.94 90 top
T1  24.42,53.63 180 top
TRANSLATOR  10.03,43.43 90 top
TXL  38.1,41.27 0 top
U$1  16.13,8.64 0 bottom
U$17  TRI_AXIS_DECAL_GYRO  [THREE_AXISGYRO_DECAL]  26.67,33.78 0 top
U$18  TRI_AXIS_DECAL  [THREEAXIS]  17.27,33.78 270 top
U$19  TRI_AXIS_DECAL  [THREEAXIS]  36.07,33.78 90 top
UGJ  44.07,64.64 90 bottom
Y1  25.91,24.13 90 top
Y2  28.96,48.51 90 top

### Tracks (layer width: path | path; a pad name or v marks a point on that pad's centre or on a via)
5VREF
  Top 0.254: 7.87,43.2 TRANSLATOR.7 | 7.87,43.2 7.87,42.8 7.87,42.7 | 7.87,42.7 TRANSLATOR.8 | C18.1 7.87,41.66 7.87,42.7 | 7.87,43.2 6.69,43.2 R1.1
+3V3  (via drill 0.61)
  Top 0.254: 11.05,36.96 v11.18,36.96 | GYRO.8 25.92,31.04 25.91,31.03 25.91,29.72 C5.2 | TRANSLATOR.2 12.45,43.2 12.45,38.99 v12.07,38.61 | GYRO.13 30.48,33.04 C2.1 | C24.1 36.2,36.29 ACC.1 | R4.2 41.15,30.86 40.77,31.24 v40.51,31.24 38.35,31.24 38.1,31.5 ACC.7 | 16,35.67 MAG.13 15.99,36.83 v16,36.83 | C7.1 11.94,32.51 11.95,32.51 11.95,32.52 v12.45,33.02 12.97,33.54 13.08,33.54 | 13.08,33.54 MAG.4 | MAG.2 13.08,34.54 13.08,33.54
  Top 0.508: v12.07,38.61 12.07,37.97 11.05,36.96 7.37,36.96 4.7,34.29 4.57,34.29 | 3V3REG.3 32.79,58.27 C13.1 34.17,56.52 34.54,56.52 34.54,56.77 | 20.83,39.5 v18.16,39.5 v16.89,39.5 v15.62,39.5 | 20.83,39.5 21.46,39.5 22.35,40.39 | 34.42,56.77 34.42,57.02 | 34.42,56.77 34.42,56.64 | 34.54,56.77 34.42,56.77 | 22.35,40.39 23.37,41.4 v23.37,41.53 | v23.37,48.39 23.11,48.64 19.81,48.64 19.3,48.13 IC1.2 | v35.56,58.29 35.43,58.29 v34.54,59.18 34.54,56.77 | v35.56,58.29 35.69,58.17 v35.69,57.02 34.42,57.02 | 34.42,57.02 34.42,57.15 v35.56,58.29 | R12.1 15.11,42.58 v15.11,44.07 15.07,44.11 R13.1 | v24.64,41.53 23.49,40.39 22.35,40.39 | v29.34,39.12 31.5,36.96 31.5,34.04 30.9,33.44 C2.1 | C24.1 34.63,35.39 34.16,34.92 34.16,32.26 v34.42,32 | POWER.2 4.57,34.29 | 4.57,34.29 7.24,31.62 11.85,31.62 C7.1 | C5.2 25.11,30.23 23.37,31.96 23.37,35.31 22.73,35.94 22.73,37.59 20.83,39.5 | 34.42,56.77 34.16,56.77
  Bottom 0.254: v12.45,33.02 12.83,33.4 12.83,35.56 14.1,36.83 v16,36.83
  Bottom 0.508: 34.54,57.28 34.54,52.58 23.49,41.53 v23.37,41.53 | 34.54,57.28 v34.54,59.18 35.43,58.29 v35.56,58.29 | v23.37,41.53 v23.37,48.39 | v23.37,41.53 23.24,41.66 | v35.56,58.29 35.69,58.17 v35.69,57.02 34.67,57.02 | 34.54,57.28 v35.56,58.29 | v24.64,41.53 v23.37,41.53 | v11.18,36.96 11.18,37.72 v12.07,38.61 12.95,39.5 v15.62,39.5 v16.89,39.5 v18.16,39.5 28.96,39.5 v29.34,39.12 35.69,39.12 36.58,38.23 36.58,32.64 | v15.11,44.07 17.78,44.07 19.18,42.67 22.22,42.67 v23.37,41.53 | 36.58,32.64 35.81,32.64 35.18,32 v34.42,32 | 36.58,32.64 39.12,32.64 v40.51,31.24
+5V  (via drill 0.61)
  Top 0.254: RN4.8 20.7,41.04 20.7,40.26 19.83,40.26 | 19.83,40.26 RN4.7 | RN3.3 34.18,11.43 34.98,11.43 RN3.4 | AVR2.4 34.8,48.51 34.04,48.51 32.89,47.37 v32.89,45.72 | 19.83,40.26 19.81,40.26 19.68,40.39 17.27,40.39 17.27,41.78 v17.14,41.91 | RN2.2 42.15,40.24 42.29,40.39 42.29,40.64 | RN2.3 42.15,41.04 42.29,40.89 42.29,40.64 | ICSP2.2 44.7,45.72 42.8,43.81 42.8,40.64 42.29,40.64 | AVR2.32 36.35,51.03 36.03,51.35 C10.1
  Top 0.508: 5VREG.3 23.7,59.77 C12.1 25.4,59.56 25.02,59.18 | 25.5,56.9 21.21,56.9 18.03,53.72 IC1.8 15.94,49.91 14.48,49.91 13.34,48.77 13.34,47.37 10.92,44.96 9.27,44.96 8.76,45.47 8.76,46.48 7.62,47.62 4.95,47.62 4.99,47.59 R11.1 R10.1 R1.2 4.7,43.18 3.43,41.91 3.43,39.88 | 25.5,56.9 C15.1 24.26,58.29 v24.26,58.42 | 25.5,56.9 28.19,59.59 28.19,59.79 | 28.19,59.79 3V3REG.1 | 28.19,59.79 28.19,59.82 | v24.13,56.9 24.13,58.29 v24.26,58.42 | v24.26,58.42 25.02,59.18 | 25.02,59.18 v25.27,59.18 25.27,57.15 25.65,56.77 | 25.4,52.45 25.36,52.45 T1.2 | ICSP1.2 30.48,2.79 32.89,5.21 | 34.98,11.43 36.32,10.09 36.32,8.64 32.89,5.21 | v32.89,45.72 30.61,43.43 26.67,43.43 24.76,45.34 24.76,51.94 25.4,52.58 T1.2 | v11.43,41.66 11.43,39.88 10.92,39.37 10.92,38.61 10.16,37.85 5.46,37.85 3.43,39.88 | 23.24,9.65 23.24,8.25 23.88,7.62 30.73,7.62 32.89,5.46 32.89,5.21 | 23.24,9.65 23.24,11.05 25.15,12.95 25.18,12.95 C9.2 25.18,21.34 22.22,21.34 | 3.43,39.88 2.41,39.88 0.64,38.1 0.64,33.65 POWER.3 2.54,31.62 4.45,29.72 4.45,29.21 6.22,27.43 6.48,27.18 | AVR1.4 22.22,20.55 22.22,21.34 | 22.22,21.34 22.22,22.16 AVR1.6 | 6.48,27.18 6.48,23.24 v4.95,21.72 | v10.16,6.48 13.34,9.65 v18.92,9.65 | v21.97,9.65 23.24,9.65 | C10.1 33.62,51.31 32.89,51.31 30.23,53.97 v29.97,53.97 v28.57,53.97 v27.3,53.97 26.73,53.97 T1.2 | L2.2 8.51,25.15 6.48,27.18
  Bottom 0.508: v24.13,56.9 24.13,58.29 v24.26,58.42 | v24.26,58.42 25.02,59.18 v25.27,59.18 25.27,57.28 | 25.27,57.28 25.27,56.9 | v24.13,56.9 25.27,56.9 | v24.26,58.42 24.26,58.29 25.27,57.28 | 25.27,55.63 24.13,56.77 v24.13,56.9 | 25.27,56.9 25.27,55.63 | v32.89,45.72 36.32,49.15 43.56,49.15 ICSP2.2 | v4.95,21.72 4.95,12.45 4.45,11.94 4.45,5.59 4.83,5.21 8.89,5.21 v10.16,6.48 | v18.92,9.65 v21.97,9.65 | v28.57,53.97 v27.3,53.97 | v28.57,53.97 v29.97,53.97 | 25.27,55.63 26.92,55.63 v28.57,53.97 | v11.43,41.66 14.22,41.66 14.48,41.91 v17.14,41.91
ACCINT1  (via drill 0.61)
  Top 0.254: v43.05,18.41 43.05,20.32 42.04,21.34 42.04,24.77 42.55,25.27 42.55,30.86 41.12,32.29 ACC.8
  Bottom 0.254: J2.R1 33.4,17.14 34.67,18.41 v43.05,18.41
ACCINT2  (via drill 0.61)
  Top 0.254: ACC.9 40.95,33.09 42.67,31.37 43.18,30.86 v43.18,23.5
  Bottom 0.254: v43.18,23.5 34.16,23.5 J2.R3
AD0
  Top 0.254: AVR1.23 2.63,18.96 ADH1.1
AD1
  Top 0.254: AVR1.24 3.93,18.16 ADH1.2
AD2
  Top 0.254: AVR1.25 13.71,15.87 11.81,13.97 ADH1.3
AD3
  Top 0.254: AVR1.26 14.51,15.4 10.67,11.56 10.54,11.43 ADH1.4
AD6  (via drill 0.61 pad 0.81)
  Top 0.254: AVR1.19 10.61,22.16 v10.03,22.73
  Bottom 0.254: ADH2.1 13.34,2.54 13.34,4.45 13.34,14.22 11.56,16 11.05,16 10.29,16 9.4,16.89 9.4,17.02 9.4,22.1 v10.03,22.73
AD7  (via drill 0.61 pad 0.81)
  Top 0.254: AVR1.22 10.6,19.76 v10.41,19.94
  Bottom 0.254: ADH2.2 16.31,3.63 13.97,5.97 13.97,14.35 11.68,16.64 10.41,16.64 v10.41,19.94
AREF  (via drill 0.61 pad 0.81)
  Top 0.254: v8.38,23.5 C16.1 9.14,21.93 9.72,21.36 AVR1.20
  Bottom 0.254: IOH.8 45.85,40.64 20.32,40.64 19.94,41.02 14.73,41.02 14.35,40.64 11.3,40.64 6.98,36.32 6.98,33.15 10.03,30.1 10.03,25.15 v8.38,23.5
AUTORES  (via drill 0.61)
  Top 0.254: C17.2 v32.77,43.31 | AVR2.13 38.35,44.7 v39.44,43.62 39.44,42.22 39.82,41.84 RN2.5
  Bottom 0.254: v32.77,43.31 33.08,43.62 v39.44,43.62
BI2
  Bottom 0.254: J2.L1 44.96,17.14 IOL.3
BI3
  Bottom 0.254: J2.L2 45.21,19.69 IOL.4
BI4
  Bottom 0.254: J2.L3 44.96,22.23 IOL.5
BI5
  Bottom 0.254: J2.L4 45.21,24.77 IOL.6
CPOUT
  Top 0.254: C1.2 27.42,37.54 GYRO.20
D+
  Top 0.254: RN6.7 38.86,57.21 38.86,58.04 39.37,58.55 43.05,58.55 44.05,59.54 MINIUSB.D+ 45.45,58.16 R2.1
D-  (via drill 0.61)
  Top 0.254: RN6.8 38.1,57.25 38.1,58.17 41.78,61.85 43.82,61.85 44.87,60.79 MINIUSB.D- | v47.24,59.05 47.24,57.66 | 47.24,57.66 47.24,57.17 | R3.1 47.26,57.64 47.24,57.66
  Bottom 0.254: v47.24,59.05 47.24,59.69 46.23,60.71 44.91,60.71 MINIUSB.D-
GATECMD
  Top 0.254: T1.3 23.43,50.99 21.84,49.4 19.3,49.4 18.03,48.13 IC1.1
GND  (via drill 0.61)
  Top 0.254: AVR1.5 19.03,21.36 v18.67,21.72 | AVR1.21 11.07,20.55 10.79,20.83 9.53,20.83 9.4,20.7 8.68,20.7 | GYRO.18 28.68,35.54 | 28.68,35.54 28.96,35.81 | GYRO.11 27.42,31.76 27.94,31.24 | 28.68,35.54 29.32,35.54 29.72,35.94 | GYRO.1 24.67,35.78 v24,36.45 | RN4.6 19.03,41.38 19.43,41.78 21.59,41.78 v21.72,41.66 | TRANSLATOR.1 10.83,42.7 10.41,42.29 10.41,40.26 9.27,39.12 7.24,39.12 5.84,40.51 | ACC.12 40.2,35.49 40.26,35.43 | AVR1.3 20.73,19.69 19.56,19.69 19.43,19.56 19.18,19.56 | 37.97,33.65 38.1,33.78 | ACC.4 37.11,33.78 37.85,33.78 38.1,34.04 38.1,35.49 | ACC.12 39.14,35.43 | 38.1,35.49 ACC.12 | 38.1,35.49 ACC.2 | C23.2 38.67,28.19 37.47,28.19 35.81,29.85 35.81,31.88 35.31,32.38 C24.2 | GYRO.9 26.42,28.96 | AVR2.EXP 37.35,49.01 AVR2.3 33.39,49.01 31.88,47.5 31.88,46.86 v31.62,46.61 | 16.62,33.53 MAG.9 17.65,33.54 17.65,33.15 v17.78,33.02 | MAG.11 17.39,34.54 17.91,35.05 v17.91,35.31
  Bottom 0.254: 33.78,30.73 33.78,30.61
  other vias: 42.16,15.37 40.77,15.37 44.96,15.37 43.56,15.37 33.53,7.62 32.64,8.51 46.74,3.81 48.13,3.81 49.53,3.81 50.93,3.81 17.53,4.32 18.54,3.3 18.54,1.9 4.06,3.94 11.18,3.3 12.19,4.32 11.18,1.9 20.32,59.18 20.32,66.55 19.05,66.55 21.59,66.55 21.59,65.28 20.32,65.28 19.05,65.28 17.53,63.75 18.92,63.75 20.32,63.75 21.72,63.75 23.11,63.75 17.53,61.98 18.92,61.98 20.32,61.98 21.72,61.98 23.11,61.98 30.48,63.75 29.08,63.75 27.69,63.75 31.88,63.75 33.27,63.75 30.48,61.98 31.88,61.98 33.27,61.98 29.08,61.98 27.69,61.98 30.48,59.18 30.48,66.55 29.21,66.55 31.75,66.55 31.75,65.28 30.48,65.28 29.21,65.28 21.84,44.58 20.57,54.1 21.97,54.1 31.5,51.18 32.39,53.72 25.91,46.1 17.4,18.41 18.67,23.11 29.97,36.45 29.08,31.24 26.29,20.7 27.43,21.59 3.43,46.86 3.43,45.47 3.43,44.07 5.08,40 43.43,37.46 42.04,37.46 31.5,14.61 27.69,12.45 29.08,12.45 30.48,12.45 1.27,3.94 2.67,3.94 6.73,28.83 20.83,25.4 21.72,26.29 41.15,43.31 51.82,59.69 51.82,61.09 51.82,62.48 18.67,19.18 23.24,27.43 24.38,27.43 35.94,31.12 28.07,23.5 40.64,37.46 5.71,29.85 44.07,43.43
  pour Bottom (isolate 0.381, no thermals): -9.78,76.71 -9.78,-8.13 60.2,-8.13 60.2,76.71
  pour Top (isolate 0.381, no thermals): -6.1,74.93 -6.1,-5.21 56.77,-5.21 56.77,74.93
GYROINT
  Top 0.254: GYRO.12 29.43,32.29 34.16,27.56 34.16,20.96 J2.R2
INT0  (via drill 0.61)
  Top 0.254: v21.84,15.88 19.31,15.88 AVR1.32
  Bottom 0.254: v21.84,15.88 31.5,15.88 34.16,15.88 J2.M1
INT1  (via drill 0.61)
  Top 0.254: v23.62,17.27 22.74,18.16 AVR1.1
  Bottom 0.254: v23.62,17.27 27.81,17.27 28.96,18.41 31.5,18.41 33.66,18.41 34.93,19.69 J2.M2
IO4  (via drill 0.61)
  Top 0.254: v23.49,18.92 23.46,18.96 AVR1.2
  Bottom 0.254: v23.49,18.92 26.29,18.92 28.32,20.96 31.5,20.96 34.16,20.96 J2.M3
IO5  (via drill 0.61)
  Top 0.254: AVR1.9 19.31,26.42 v19.94,27.05
  Bottom 0.254: v19.94,27.05 20.7,27.81 21.21,28.32 21.34,28.45 25.02,28.45 25.27,28.19 27.05,26.42 27.3,26.42 27.69,26.42 31.11,26.42 33.78,26.42 J2.M4
IO6  (via drill 0.61)
  Top 0.254: AVR1.10 18.54,25.28 18.54,26.92 18.92,27.3 v18.92,28.07
  Bottom 0.254: v18.92,28.07 18.92,28.7 19.18,28.96 25.27,28.96 27.3,26.92 34.42,26.92 35.18,26.16 46.1,26.16 IOL.7
IO7  (via drill 0.61)
  Top 0.254: AVR1.11 17.78,25.25 v17.78,28.83
  Bottom 0.254: v17.78,28.83 17.78,29.21 18.03,29.46 25.53,29.46 27.56,27.43 34.8,27.43 35.56,26.67 48.39,26.67 IOL.8
IO8  (via drill 0.61)
  Top 0.254: AVR1.12 16.91,26.91 16.51,27.3 v16.51,28.07
  Bottom 0.254: v16.51,28.07 16.51,29.72 16.76,29.97 25.78,29.97 27.81,27.94 35.18,27.94 35.94,27.18 49.91,27.18 IOH.1
IO9  (via drill 0.61)
  Top 0.254: AVR1.13 16.13,25.25 16.13,26.54 15.49,27.18 v15.49,29.59
  Bottom 0.254: IOH.2 50.04,30.48 47.24,27.69 36.2,27.69 35.43,28.45 28.07,28.45 26.04,30.48 15.75,30.48 15.49,30.23 v15.49,29.59
M8RXD
  Top 0.254: AVR2.9 34.69,44.2 34.67,44.2 34.67,39.62 33.4,38.35 33.4,31.37 37.97,26.8 39.37,26.8 40.77,25.4 40.77,17.78 40.77,17.02 39.12,15.37 38.99,15.24 34.16,15.24 33.4,14.48 33.4,13.65 RN3.7
M8TXD
  Top 0.254: RN3.8 32.58,14.55 32.58,15.06 33.4,15.88 38.73,15.88 39.88,17.02 39.88,25.4 39.12,26.16 37.72,26.16 32.77,31.12 32.77,38.48 34.16,39.88 34.16,44.97 AVR2.8
MAGINT
  Top 0.254: J2.R4 32.89,24.51 32,23.62 29.72,23.62 26.92,26.42 22.86,26.42 21.84,27.43 21.84,37.21 20.57,38.48 15.88,38.48 14.99,37.6 MAG.15
MISO  (via drill 0.61)
  Top 0.254: AVR1.16 | AVR1.16 13.71,24.01 13.72,24 13.72,23.62 14.99,22.35 v15.49,22.35 | AVR1.16 13.71,25.66 12.45,26.92 v12.45,28.07
  Bottom 0.254: ICSP1.1 28.7,6.99 27.94,7.75 18.41,7.75 15.24,10.92 15.24,19.18 15.49,19.43 v15.49,22.35 | v12.45,28.07 12.45,31.12 13.34,32 26.8,32 28.83,29.97 36.2,29.97 36.96,29.21 41.78,29.21 IOH.5
MISO2  (via drill 0.61)
  Top 0.254: AVR2.17 41.43,46.51 41.91,46.99 v41.91,47.75
  Bottom 0.254: ICSP2.1 47.24,46.61 46.1,45.47 44.45,45.47 42.16,47.75 v41.91,47.75
MOSI  (via drill 0.61)
  Top 0.254: v16.64,23.37 15.11,23.37 14.48,24 14.48,24.7 14.51,24.73 AVR1.15 14.51,26 13.46,27.05 v13.46,29.08
  Bottom 0.254: ICSP1.4 26.16,1.65 26.54,1.27 30.23,1.27 30.73,1.78 30.73,6.22 28.57,8.38 18.54,8.38 15.88,11.05 15.88,18.67 16.64,19.43 v16.64,23.37 | v13.46,29.08 13.46,30.99 13.97,31.5 26.54,31.5 28.57,29.46 35.94,29.46 36.7,28.7 44.07,28.7 IOH.4
MOSI2
  Top 0.254: AVR2.16 41.54,45.86 43.18,47.5 43.18,48.77 ICSP2.4
N$1
  Top 0.254: MAG.10 19.63,34.04 C6.1
N$2
  Top 0.254: C3.1 26.92,30.52 GYRO.10
N$5
  Top 0.254: R4.1 40.73,27.98 40.26,28.45 40.26,28.96 39.31,29.91 C23.1 37.66,29.91 37.08,30.48 37.08,32.21 ACC.6
N$8
  Top 0.254: RXL.A 36.07,39.5 36.45,39.12 38.86,39.12 39.99,40.24 RN2.7
N$9
  Top 0.254: 38.1,39.75 TXL.A 39.08,40.22 39.9,41.04 RN2.6
N$10
  Top 0.254: AVR1.18 11.27,22.96 10.92,23.3 10.92,24.88 L2.1
  Top 0.508: C8.2 11.19,26.44 L2.1
N$99
  Top 0.254: RN2.1 43.54,39.44 44.07,39.97 L.A
PWRIN
  Top 0.508: POWERJACK.PWR 5.22,53.75 DIODE1.A
PWRLED
  Top 0.254: RN3.6 34.18,14.35 34.54,14.35 34.98,14.35 | 34.98,14.35 RN3.5 | 34.98,14.35 37.25,14.35 37.21,14.32 38.48,13.05 POWERLED.A
RD+
  Top 0.254: RN6.2 38.84,54.72 37.85,53.72 AVR2.29
RD-
  Top 0.254: RN6.1 38.04,54.68 37.34,53.97 AVR2.30
RESET  (via drill 0.61, 0.61 pad 0.81)
  Top 0.254: AR-ENABLE.2 AR-ENABLE.1 31.62,42.04 31.62,41.02 32.39,40.26 32.77,40.26 C17.1 | AVR1.29 16.91,12.05 v18.03,10.92 19.3,10.92 20.32,9.91 20.32,8.64 ICSP1.5 | v25.02,9.4 S1.1 S1.2 30.35,18.41 36.7,18.41 36.7,26.29 32.26,30.73 32.26,37.34 30.48,39.12 30.48,40.51 AR-ENABLE.2 | AR-ENABLE.2 29.21,40.51 27.18,42.54 26.54,42.54 25.53,43.56 20.19,43.56 v20.07,43.69 19.83,43.45 RN4.2
  Bottom 0.254: v25.02,9.4 23.49,10.92 v18.03,10.92 | POWER.1 2.41,36.96 2.41,47.5 5.08,50.16 11.94,50.16 14.61,47.5 15.62,47.5 19.43,43.69 v20.07,43.69
RESET2  (via drill 0.61)
  Top 0.254: ICSP2.5 47.24,53.21 46.1,54.36 45.97,54.48 44.07,54.48 42.93,53.34 42.93,51.56 41.4,50.04 41.37,50.01 AVR2.24 40.53,50.04 | RN4.1 20.63,42.86 20.7,42.93 24.64,42.93 v26.04,41.53
  Bottom 0.254: ICSP2.5 47.37,53.09 49.91,50.55 49.91,49.53 49.91,46.74 45.21,42.04 44.45,41.27 43.18,41.27 26.54,41.27 26.29,41.27 v26.04,41.53
RXD  (via drill 0.61 pad 0.81)
  Top 0.254: AVR1.30 17.71,12.64 v17.91,12.45 | RN3.2 33.38,10.69 v33.91,10.16
  Bottom 0.254: v17.91,12.45 23.62,12.45 25.65,10.41 25.91,10.16 v33.91,10.16 35.81,8.25 48.26,8.25 50.16,6.35 IOL.1
RXLED
  Top 0.254: RXL.C 36.07,44.07 36.07,44.32 36.83,45.09 36.83,45.34 36.83,45.84 AVR2.10
SCK  (via drill 0.61 pad 0.81)
  Top 0.254: AVR1.17 | AVR1.17 12.1,23.88 | AVR1.17 12.22,23.85 | RN2.8 41.18,38.61 48.9,38.61 IOH.6 | v14.48,20.83 14.48,22.23 12.95,23.76 AVR1.17
  Bottom 0.254: IOH.6 46.61,40.64 46.1,40.13 19.94,40.13 19.56,40.51 14.99,40.51 14.61,40.13 11.56,40.13 7.62,36.2 7.62,33.27 10.67,30.23 10.67,24.64 v14.48,20.83 14.61,20.7 14.61,10.67 18.16,7.11 25.4,7.11 26.16,6.35 ICSP1.3
SCK2  (via drill 0.61)
  Top 0.254: AVR2.15 39.35,45.36 39.75,44.96 39.88,44.83 v41.02,44.83
  Bottom 0.254: ICSP2.3 48.64,50.55 49.15,50.04 49.15,47.12 48.26,46.23 46.48,44.45 43.43,44.45 41.4,44.45 v41.02,44.83
SCLH  (via drill 0.61, 0.61 pad 0.81)
  Top 0.254: ADH1.6 5.21,6.35 v5.84,6.35 8,6.35 16.13,14.48 16.13,16.64 AVR1.28 | R10.2 6.98,44.7 7.99,43.7 TRANSLATOR.6 9.4,43.7 9.4,42.04 v7.62,40.26
  Bottom 0.254: v7.62,40.26 7.62,38.61 5.71,36.7 5.71,32.64 8.76,29.59 8.76,26.92 6.73,24.89 6.73,12.32 5.84,11.43 v5.84,6.35
SCLL  (via drill 0.61)
  Top 0.254: TRANSLATOR.3 13.37,43.7 R12.2 13.37,38.1 v13.37,37.59 13.37,35.04 MAG.1 | v25.91,37.59 25.92,37.58 GYRO.23 | ACC.14 38.1,37.21 35.05,37.21 v34.67,36.83
  Bottom 0.254: v34.67,36.83 32.77,36.83 32,37.59 v25.91,37.59 23.62,37.59 23.37,37.85 15.49,37.85 15.24,37.59 v13.37,37.59
SDAH  (via drill 0.61, 0.61 pad 0.81)
  Top 0.254: AVR1.27 15.31,14.93 10.03,9.65 v7.37,9.65 6.6,8.89 ADH1.5 | R11.2 7.24,46.23 7.87,45.59 7.87,44.58 8.25,44.2 TRANSLATOR.5 9.91,44.2 9.91,41.15 v9.02,40.26
  Bottom 0.254: v7.37,9.65 7.37,24.64 9.4,26.67 9.4,29.85 6.35,32.89 6.35,36.45 8.26,38.35 8.26,39.5 v9.02,40.26
SDAL  (via drill 0.61)
  Top 0.254: TRANSLATOR.4 12.67,45.47 R13.2 13.46,45.47 14.73,46.74 15.75,46.74 16.26,46.23 16.26,42.04 14.48,40.26 v14.48,38.48 MAG.16 | GYRO.24 25.42,36.43 24.51,37.34 v24.51,38.48 | ACC.13 39.2,37.25 38.61,37.85 35.05,37.85 34.8,38.1 v34.67,38.1
  Bottom 0.254: v34.67,38.1 26.67,38.1 26.29,38.48 v24.51,38.48 v14.48,38.48
SETC
  Top 0.254: MAG.12 16.61,35.59 C4.2
SETP
  Top 0.254: C4.1 20.57,36.83 21.21,36.2 21.21,31.5 20.45,30.73 17.27,30.73 15.99,32.02 MAG.8
SS  (via drill 0.61)
  Top 0.254: AVR1.14 15.37,25.25 15.37,26.16 14.48,27.05 v14.48,28.07
  Bottom 0.254: v14.48,28.07 14.48,30.61 14.86,30.99 26.16,30.99 28.19,28.96 35.69,28.96 36.45,28.19 45.85,28.19 IOH.3
TXD  (via drill 0.61 pad 0.81)
  Top 0.254: AVR1.31 18.51,13.62 v18.67,13.46 | v32.39,11.05 32.39,11.56 32.51,11.68 32.58,11.75 RN3.1
  Bottom 0.254: v18.67,13.46 23.49,13.46 23.88,13.08 25.91,11.05 v32.39,11.05 34.54,11.05 34.67,11.05 34.93,10.8 36.83,8.89 IOL.2
TXLED
  Top 0.254: AVR2.11 37.35,44.82 38.1,44.07 TXL.C
UGND  (via drill 0.61)
  Top 0.254: AVR2.28 38.35,52.41 C11.1 | C11.1 38.99,52.96 | C11.1 38.9,53.12 41.28,55.5 EMISUPRS.1 41.95,57.23 v41.91,57.28
  Bottom 0.254: UGJ.1 41.91,61.72 41.91,60.32 42.47,59.77 MINIUSB.GND 41.91,58.98 v41.91,57.28
USBSHIELD
  Top 0.254: R2.2 44.15,56.7 EMISUPRS.2 47.36,55.5 R3.2
  Top 0.406: MINIUSB.MTN@2 MINIUSB.MTN@1 49.26,63.1 R3.2
USBVCC
  Top 0.254: 36.83,54.99 36.83,50.68 AVR2.31
  Top 0.508: L1.2 36.83,54.99 36.64,54.8 C21.2 | T1.1 24.4,55.24 33.27,55.24 33.72,54.8 C21.2 | C21.2 35.37,54.8
VIN  (via drill 0.61)
  Top 0.508: C14.1 16.31,61.46 5VREG.1 18.01,56.11 16.51,54.61 16.51,52.32 v15.37,51.18 12.57,51.18 11.43,50.04 | RN4.4 18.23,43.36 17.02,44.58 17.02,46.61 15.37,48.26 v15.37,48.77 | 11.43,49.02 11.43,47.5 v11.05,47.12 | 11.43,49.02 11.43,50.04 | 11.43,50.04 DIODE1.C | v11.05,47.12 v10.03,46.1 9.78,46.35 v9.78,47.37 | v11.05,47.12 10.79,47.37 v9.78,47.37 | v9.78,47.37 11.43,49.02
  Bottom 0.508: POWER.6 4.83,24.13 8,27.3 8,29.34 4.95,32.38 4.95,37.08 6.22,38.35 6.22,42.29 v10.03,46.1 | v15.37,51.18 v15.37,48.77 | v10.03,46.1 9.78,46.35 v9.78,47.37 10.79,47.37 v11.05,47.12 v10.03,46.1
VIN/2
  Top 0.254: IC1.3 20.57,45.72 19.68,44.83 19.03,44.18 RN4.3 19.03,42.14 18.8,41.91 18.23,41.34 RN4.5
VUCAP
  Top 0.254: AVR2.27 38.85,51.68 39.24,52.07 39.71,52.07 C11.2
XT1
  Top 0.254: Y2.3 29.4,48.77 31.37,48.77 32.61,50.01 AVR2.1 | Y2.3 27.81,52.4 27.93,52.4 C20.1 | Y2.3 27.04,50.36 R7.2
XT2
  Top 0.254: Y2.1 32.95,49.51 AVR2.2 | Y2.1 30.11,45 29.98,45 C19.1 | Y2.1 28.38,48.39 26.92,48.39 26.2,47.66 R7.1
XTAL1
  Top 0.254: AVR1.7 22.57,22.96 22.86,23.24 23.71,23.24 R6.2 24.47,23.28 24.76,22.99 25.85,22.99 Y1.1
XTAL2
  Top 0.254: AVR1.8 21.47,23.76 22.73,25.02 23.71,25.02 R6.1 24.47,24.98 24.76,25.27 25.85,25.27 Y1.3
XUSB
  Top 0.508: MINIUSB.VBUS 46.23,60.1 46.23,62.61 45.72,63.12 42.29,63.12 41.78,62.61 39.62,62.61 39.03,62.61 L1.1

### Text on the board
Top: IMU v0.1
tPlace: AREF | RX | TX | L | GND | 13 | AUTO | RESET | 12 | Reset | *11 | 3V3 | POWER | *10 | 5V | [*=PWM] | DIGITAL | *9 | GND | 8 | SENSOR | MAG | D5 | 7 | VIN | FFL | *6 | D4 | GYR | ANALOG IN | D3 | *5 | 0 | ACC | 4 | D2 | 1 | HEAD | *3 | 2 | Y | 2 | 3 | X | Z | TX | 1 | 4 | RX | 0 | 5 | PWR | 6 | 7
bPlace: UGND | 7-12v | Inner + | X | Y | Z | Y | Y | Z | X | Z | X | AHRSuIMU